# Altium schematic sheet MCU.SchDoc
size A; SheetNumber: 2; SheetTotal: 4
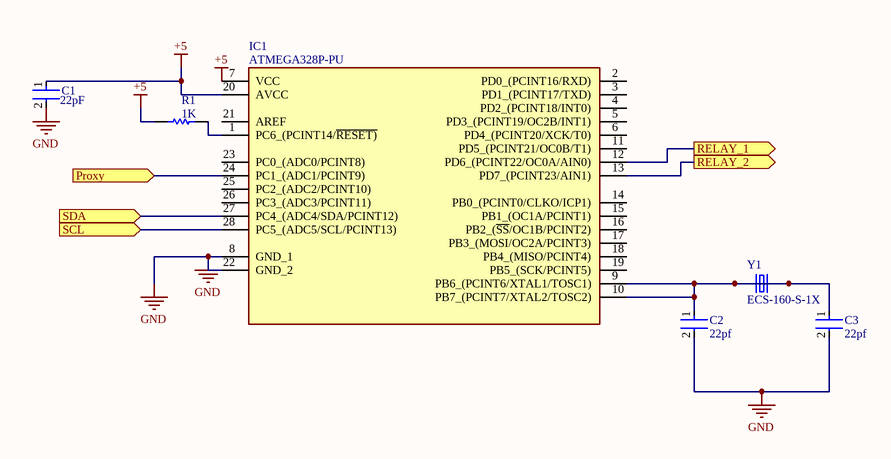
[diagram p0: MCU.SchDoc]

## Parts
C1  22pf  [FP-VY2472M49Y5UG63V7-MFG]
C2  22pf  [FP-VY2472M49Y5UG63V7-MFG]
C3  22pf  [FP-VY2472M49Y5UG63V7-MFG]
IC1  ATMEGA328P-PU  [DIP794W53P254L3467H457Q28N]
R1  1K  [RESA60-630X240]
Y1  ECS-160-S-1X  [XTAL_ECS-160-S-1X]

## Ports
Proxy (in), RELAY_1 (out), RELAY_2 (out), SCL (in), SDA (in)

## Nets
+5: C1.1 IC1.7(VCC) IC1.20(AVCC) R1.1
GND: C1.2 C2.2 C3.2 IC1.8(GND_1) IC1.22(GND_2)
Proxy: IC1.24(PC1_(ADC1/PCINT9)) ; port Proxy
RELAY_1: IC1.12(PD6_(PCINT22/OC0A/AIN0)) ; port RELAY_1
RELAY_2: IC1.13(PD7_(PCINT23/AIN1)) ; port RELAY_2
SCL: IC1.28(PC5_(ADC5/SCL/PCINT13)) ; port SCL
SDA: IC1.27(PC4_(ADC4/SDA/PCINT12)) ; port SDA
NetC2_1: C2.1 C3.1 IC1.9(PB6_(PCINT6/XTAL1/TOSC1)) IC1.10(PB7_(PCINT7/XTAL2/TOSC2)) Y1.1 Y1.2
NetIC1_1: IC1.1(PC6_(PCINT14/~{RESET)}) R1.2

Not connected (* = marked no-connect by the designer): IC1 2(PD0_(PCINT16/RXD)) 3(PD1_(PCINT17/TXD)) 4(PD2_(PCINT18/INT0)) 5(PD3_(PCINT19/OC2B/INT1)) 6(PD4_(PCINT20/XCK/T0)) 11(PD5_(PCINT21/OC0B/T1)) 14(PB0_(PCINT0/CLKO/ICP1)) 15(PB1_(OC1A/PCINT1)) 16(PB2_(~{SS}/OC1B/PCINT2)) 17(PB3_(MOSI/OC2A/PCINT3)) 18(PB4_(MISO/PCINT4)) 19(PB5_(SCK/PCINT5)) 21(AREF) 23(PC0_(ADC0/PCINT8)) 25(PC2_(ADC2/PCINT10)) 26(PC3_(ADC3/PCINT11))

## Library data of the parts
C1-C3 = CMP-02417-000047-1: Capacitor Ceramic 4700pF ±20% Y5U BULK RADIAL; Lead/Base Style: Kinked; Capacitance: 4.7nF; Voltage Rating (DC): 300V; Body Diameter: 12.5mm; Lead Diameter: 0.6mm; Dissipation Factor: 2.5%; Mount: Through Hole; Package Quantity: 1000; Packaging: Bulk; Case/Package: Radial; Resistor Type: Ceramic; Termination: Radial; Series: VY2; Dielectric: Y5U; RoHS Compliant: Yes; Weight: 0.040932oz; Height - Seated (Max): 0.65inch; Tolerance: 20%; Lead Pitch: 7.5mm; REACH SVHC: No SVHC; Voltage Rating: 300V; Thickness: 5mm; Diameter: 12.5mm; Voltage Rating (AC): 300V; Max Operating Temperature: 125°C; Min Operating Temperature: -40°C
  C1: value: 22pF
IC1 = ATMEGA328P-PU: Integrated Circuit; Manufacturer_Name: Microchip; Datasheet Link: https://www.mouser.ca/datasheet/2/268/ATmega48A_PA_88A_PA_168A_PA_328_P_DS_DS40002061B-3050139.pdf; Height: 4.572mm; Manufacturer_Part_Number: ATMEGA328P-PU; Mouser Part Number: 556-ATMEGA328P-PU; Mouser Price/Stock: https://www.mouser.co.uk/ProductDetail/Microchip-Technology/ATMEGA328P-PU?qs=K8BHR703ZXguOQv3sKbWcg%3D%3D; Arrow Part Number: ATMEGA328P-PU; Arrow Price/Stock: https://www.arrow.com/en/products/atmega328p-pu/microchip-technology?region=europe
R1 = CMP-1659-00074-2: Axial Resistor, 10 KOhm, +/- 1%, 0.25 W, -55 to 155 degC, 2-Pin THD, RoHS, Bulk; Manufacturer: Yageo; Temperature Coefficient: 100ppm\/degreesC; Voltage Rating: 250V; Voltage Rating (DC): 200V; Resistance: 1KOhm; Max Power Dissipation: 250mW; Datasheet URL: http://www.yageo.com/documents/recent/Yageo%20LR_MFR_2013.pdf; Packaging: Bulk; RoHSCompliant: True; Mount: ThroughHole; Package Reference: MFR-25; Termination: Axial; Composition: MetalFilm; Number of Terminations: 2; Package Quantity: 200; Mounting Technology: ThroughHole; Length: 0.248inch; Max Operating Temperature: 155degC; Min Operating Temperature: -55degC; Datasheet Version: 04/2013; Lead Free: LeadFree; Manufacturer URL: http://www.yageo.com/; Tolerance: 1%; Power Rating: 250mW; Package Description: 2-Pin Axial Lead, Dia 2.4 mm, Body Length 6.3 mm; Military Standard: Not; Case\/Package: Axial
Y1 = ECS-160-S-1X: 16MHz Â±30ppm Crystal Series 20 Ohms HC-49/U; MF: ECS Inc.; Value: *; MP: ECS-160-S-1X; SnapEDA_Link: https://www.snapeda.com/parts/ECS-160-S-1X/ECS%20Inc./view-part/2458894/?ref=snap; Availability: Unavailable; Package: HC49/U ECS International; Price: None